# Altium schematic sheet eps_batt.SchDoc: Battery Protection
size A4; DrawnBy: J. Reimer T. Yeung M. Au; Organization: UTAT SS; DocumentNumber: 4; Revision: 2.0; SheetNumber: 4; SheetTotal: 17
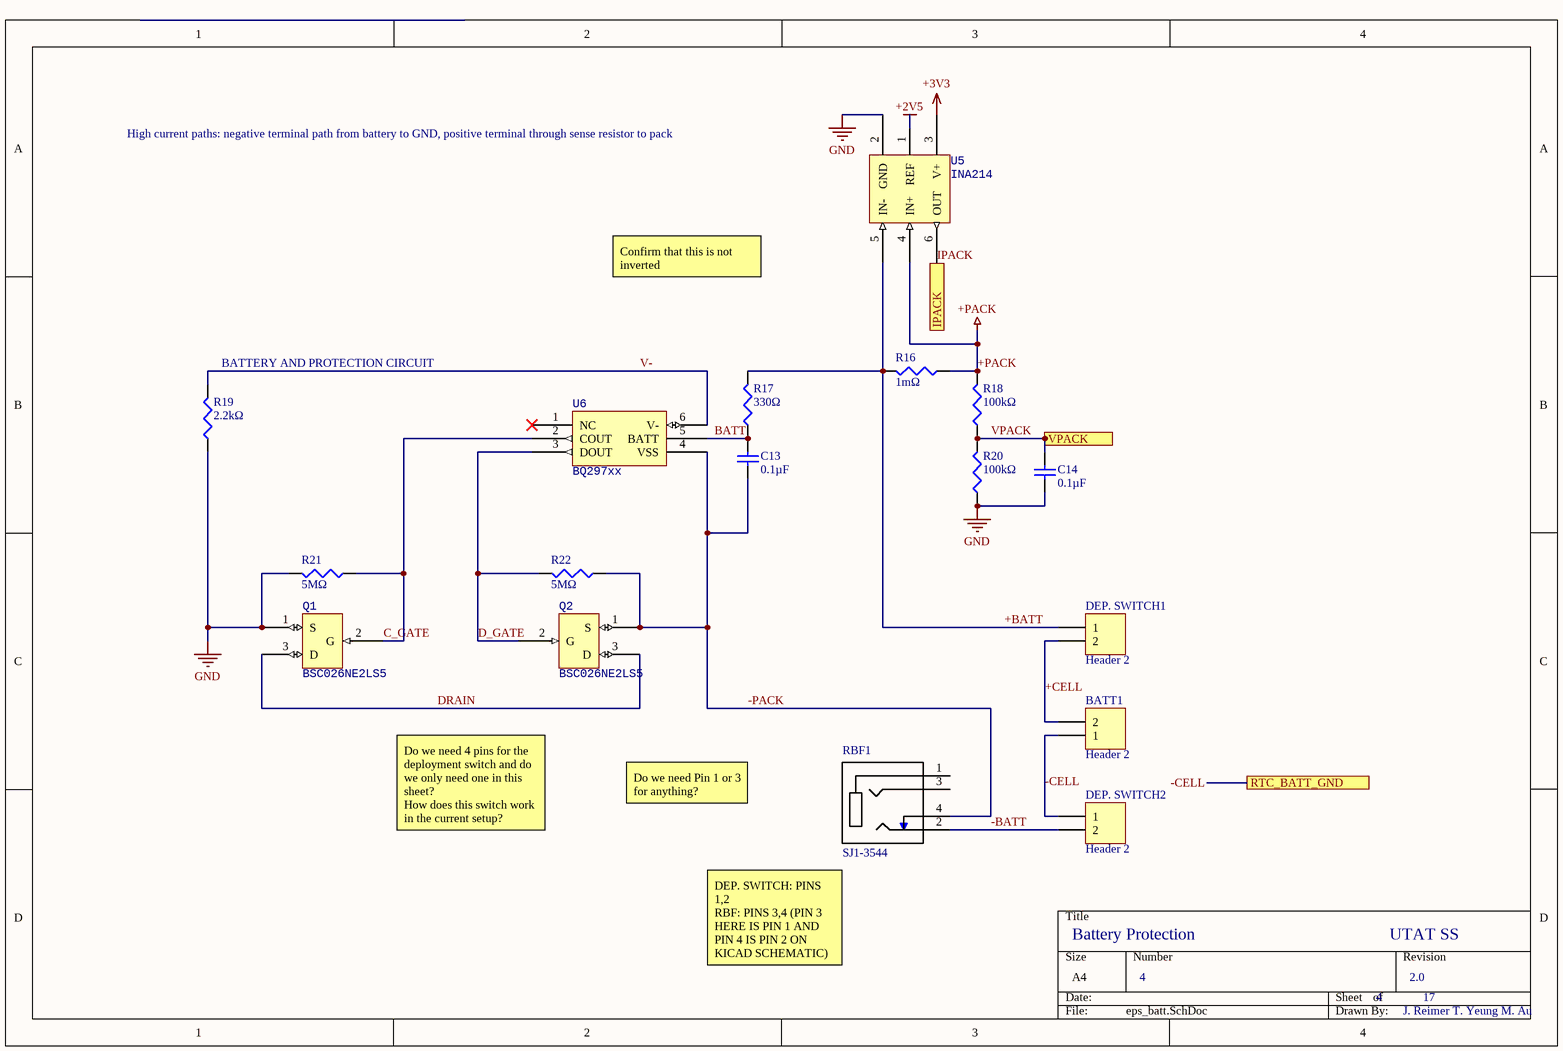
[diagram p0: eps_batt.SchDoc]

## Parts
BATT1  Header 2  [WM1351-ND]
C13  0.1µF  [1608[0603]]
C14  0.1µF  [1608[0603]]
DEP._SWITCH1  Header 2  [WM1351-ND]
DEP._SWITCH2  Header 2  [WM1351-ND]
Q1  BSC026NE2LS5  [INF-PG-TDSON-8-1_V]
Q2  BSC026NE2LS5  [INF-PG-TDSON-8-1_V]
R16  1mΩ  [C1206]
R17  330Ω  [J1-0603]
R18  100kΩ  [J1-0603]
R19  2.2kΩ  [J1-0603]
R20  100kΩ  [J1-0603]
R21  5MΩ  [J1-0603]
R22  5MΩ  [J1-0603]
RBF1  SJ1-3544  [SJ1-3544]
U5  INA214  [SOT65P210X110-6N]
U6  BQ297xx  [SON50P150X150X80-6N]

## Ports
IPACK (out), RTC_BATT_GND, VPACK (out)

## Nets
+2V5: U5.1(REF)
+3V3: U5.3(V+)
+PACK: R16.1 R18.2 U5.4(IN+)
GND: C14.1 Q1.1(S) R19.1 R20.1 R21.2 U5.2(GND)
+BATT: DEP._SWITCH1.1 R16.2 R17.2 U5.5(IN-)
+CELL: BATT1.2 DEP._SWITCH1.2
-BATT: DEP._SWITCH2.2 RBF1.2
-CELL: BATT1.1 DEP._SWITCH2.1 ; port RTC_BATT_GND
-PACK: C13.1 Q2.1(S) R22.1 RBF1.4 U6.4(VSS)
BATT: C13.2 R17.1 U6.5(BATT)
C_GATE: Q1.2(G) R21.1 U6.2(COUT)
D_GATE: Q2.2(G) R22.2 U6.3(DOUT)
DRAIN: Q1.3(D) Q2.3(D)
IPACK: U5.6(OUT) ; port IPACK
V-: R19.2 U6.6(V-)
VPACK: C14.2 R18.1 R20.2 ; port VPACK

Not connected (* = marked no-connect by the designer): RBF1 1 3; U6 1(NC)*

## Notes on the sheet
- High current paths: negative terminal path from battery to GND, positive terminal through sense resistor to pack
- Confirm that this is not inverted
- (near R19) BATTERY AND PROTECTION CIRCUIT
- Do we need Pin 1 or 3 for anything?
- Do we need 4 pins for the deployment switch and do we only need one in this sheet?
  How does this switch work in the current setup?
- DEP. SWITCH: PINS 1,2
  RBF: PINS 3,4 (PIN 3 HERE IS PIN 1 AND PIN 4 IS PIN 2 ON KICAD SCHEMATIC)

## Library data of the parts
BATT1 = Header 2: Battery Header, 2-Pin; LatestRevisionDate: 17-Jul-2002; LatestRevisionNote: Re-released for DXP Platform.; Publisher: Altium Limited; Supplier 1: Digi-Key; Supplier Part Number 1: WM1351-ND
C13 C14 = Cap Semi: Capacitor (Semiconductor SIM Model); Published: 8-Jun-2000; LatestRevisionDate: 29-May-2009; LatestRevisionNote: IPC-7351 Footprint Added.; PackageReference: C1206; Publisher: Altium Limited; PackageDescription: Chip Capacitor; Value: 0.1µF
  C13: Supplier 1: Digi-Key; Supplier Part Number 1: 311-1088-6-ND
DEP._SWITCH1 = Header 2: High-side deployment switch, 2-Pin; LatestRevisionDate: 17-Jul-2002; LatestRevisionNote: Re-released for DXP Platform.; Publisher: Altium Limited; Supplier 1: Digi-Key; Supplier Part Number 1: WM1351-ND
DEP._SWITCH2 = Header 2: Low-side deployment switch, 2-Pin; LatestRevisionDate: 17-Jul-2002; LatestRevisionNote: Re-released for DXP Platform.; Publisher: Altium Limited; Supplier 1: Digi-Key; Supplier Part Number 1: WM1351-ND
Q1 Q2 = BSC026NE2LS5: MOSFET; ComponentLink1Description: N-Channel Mosfet; ComponentLink1URL: https://www.digikey.ca/product-detail/en/infineon-technologies/BSC026NE2LS5ATMA1/BSC026NE2LS5ATMA1DKR-ND/6564538
  Q1: Supplier 1: Digi-Key; Supplier Part Number 1: BSC026NE2LS5ATMA1CT-ND
R16-R22 = Res3: Resistor; Published: 8-Jun-2000; LatestRevisionDate: 29-May-2009; LatestRevisionNote: IPC-7351 Footprint Added.; PackageReference: J1-0603; Publisher: Altium Limited; PackageDescription: Chip Resistor
  R16: Value: 1mΩ; Supplier 1: Digi-Key; Supplier Part Number 1: P.010AVDKR-ND
  R17: Value: 330Ω; Supplier 1: Digi-Key; Supplier Part Number 1: 541-330HDKR-ND
  R18: Value: 100kΩ; Supplier 1: Digi-Key; Supplier Part Number 1: 541-100KHCT-ND
  R19: Value: 2.2kΩ; Supplier 1: Digi-Key; Supplier Part Number 1: P2.20KHCT-ND
  R20: Value: 100kΩ
  R21 R22: Value: 5MΩ; Supplier 1: Digi-Key; Supplier Part Number 1: 541-330HDKR-ND
U5 = INA214: Current monitor; Supplier 1: Digi-Key; Supplier Part Number 1: 296-38956-1-ND
U6 = BQ2972: Battery protection; ComponentLink1Description: Charge Controller; ComponentLink1URL: https://www.digikey.com/product-detail/en/texas-instruments/BQ29729DSET/296-44131-1-ND/6005144; Supplier 1: Digi-Key; Supplier Part Number 1: 296-37746-6-ND
RBF1 = SJ1-3544: Value: *; Supplier 1: Digi-Key; Supplier Part Number 1: CP1-3544-ND